# Altium schematic sheet Power.SchDoc
size A4; SheetNumber: 2; SheetTotal: 3
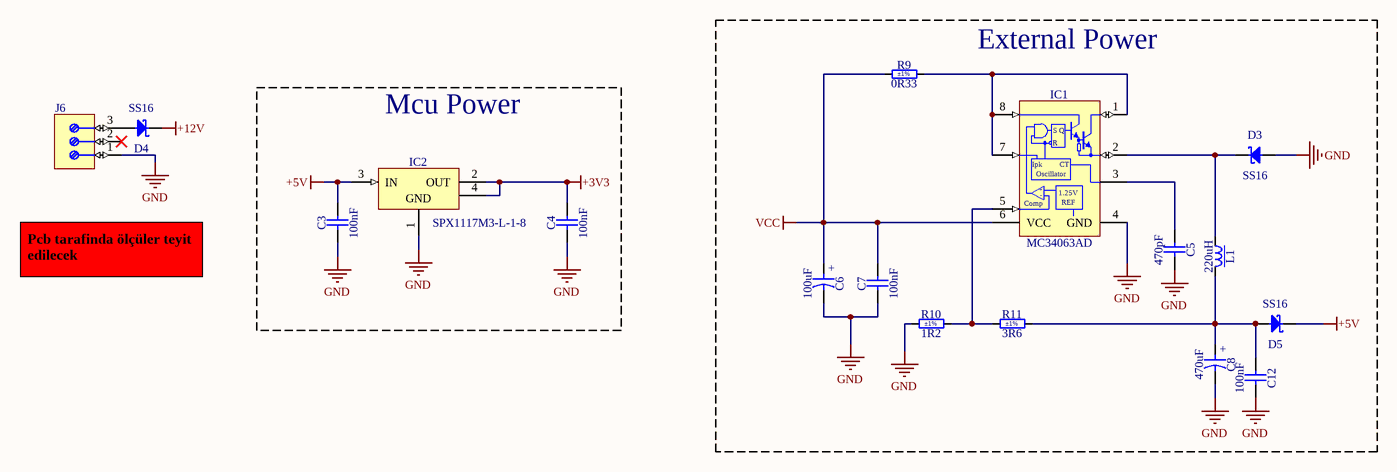
[diagram p0: Power.SchDoc]

## Parts
C3  100nF  [CAPC1608X87N]
C4  100nF  [CAPC1608X87N]
C5  470pF  [CAPC1608X87N]
C6  100uF  [CAPMP7343X200N]
C7  100nF  [CAPC1608X87N]
C8  470uF  [CAPMP7343X310N]
C12  100nF  [CAPC1608X87N]
D3  SS16  [DIOM5127X229N]
D4  SS16  [DIOM5127X229N]
D5  SS16  [DIOM5127X229N]
IC1  MC34063AD  [SOIC127P600X175-8N]
IC2  SPX1117M3-L-1-8  [SOT230P700X180-4N]
J6  (no value)  [PHOENIX_1715734]
L1  220uH  [IND_EPCOS_B82464-G4]
R9  0R33  Tolerance: ±1%  [RESC3216X65N]
R10  1R2  Tolerance: ±1%  [RESC1608X55N]
R11  3R6  Tolerance: ±1%  [RESC1608X55N]

## Blocks framed on the sheet
External Power: C5-C8 C12 D3 D5 IC1 L1 R9-R11
Mcu Power: C3 C4 IC2

## Nets
+3V3: C4.2 IC2.2(OUT) IC2.4(OUT)
+5V: C3.2 D5.1(C) IC2.3(IN)
+12V: D4.1(C)
GND: C3.1 C4.1 C5.2 C6.2 C7.1 C8.2 C12.2 D3.2(A) IC1.4(GND) IC2.1(GND) J6.1 R10.1
VCC: C6.1 C7.2 IC1.6(VCC) R9.1
NetC5_1: C5.1 IC1.3(TC)
NetC8_1: C8.1 C12.1 D5.2(A) L1.2 R11.2
NetD3_1: D3.1(C) IC1.2(SWE) L1.1
NetD4_2: D4.2(A) J6.3
NetIC1_1: IC1.1(SWC) IC1.7(Ipk) IC1.8(DRVC) R9.2
NetIC1_5: IC1.5(COMP) R10.2 R11.1

Not connected (* = marked no-connect by the designer): J6 2*

## Notes on the sheet
- Pcb tarafinda ölçüler teyit edilecek
- (in symbol CTE7343-20_100UF_10V_20%_SANYO_TPC) +
- (in symbol CTE7343-31_470UF_6.3V_10%) +
- (in symbol MC34063AD) S; Q; R; CT; Oscillator; +; -; 1.25V; Comp; REF

## Library data of the parts
C3 C4 C7 C12 = CC0603_100NF_50V_10%_X5R: Non-polarised capacitor; Part Description: SMD Multilayer Chip Ceramic Capacitor; Manufacturer: GENERIC; Manufacturer1 Part Number: C1608X5R1H104K080; Voltage: 50V; TC: X5R; Tolerance: ±10%; Part Number: CC0603_100NF_50V_10%_X5R; Component Kind: Standard; Component Type: Standard; Pin Count: 2; Value: 100nF; Status: None; Manufacturer Part Number: CC0603_100NF_50V_10%_X5R; Case: 0603; Mounted: Yes; Socket: No; SMD: Yes; Sense: No; Manufacturer1 Example: TDK; Manufacturer1 ComponentHeight: 0.9mm; HelpURL: \\cern.ch\dfs\Applications\Altium\Datasheets\CC0603_X5R_TDK_C.pdf; Author: CERN DEM MR; CreateDate: 8.01.2016; LatestRevisionDate: 8.01.2016
C5 = CC0603_470PF_50V_5%_NP0: Non-polarised capacitor; Part Description: SMD Multilayer Chip Ceramic Capacitor; Manufacturer: GENERIC; Manufacturer1 Part Number: 223886715471; Voltage: 50V; TC: C0G/NP0; Tolerance: ±5%; Part Number: CC0603_470PF_50V_5%_NP0; Component Kind: Standard; Component Type: Standard; Pin Count: 2; Value: 470pF; Status: Preferred; Manufacturer Part Number: CC0603_470PF_50V_5%_NP0; Case: 0603; Mounted: Yes; Socket: No; SMD: Yes; Sense: No; Manufacturer1 Example: PHYCOMP; Manufacturer1 ComponentHeight: 0.87mm; HelpURL: \\cern.ch\dfs\Applications\Altium\Datasheets\CC0603_NP0_PHYCOMP.pdf; Author: CERN DEM JLC; CreateDate: 3.12.2007; LatestRevisionDate: 3.12.2007
C6 = CTE7343-20_100UF_10V_20%_SANYO_TPC: Polarised capacitor; Part Description: ESR 0R045 Tantalum Chip Capacitor; Manufacturer: SANYO; Manufacturer Part Number: 10TPC100M; Voltage: 10V; Tolerance: ±20%; Part Number: CTE7343-20_100UF_10V_20%_SANYO_TPC; Component Kind: Standard; Component Type: Standard; Pin Count: 2; Value: 100uF; Status: None; Case: V; Mounted: Yes; Socket: No; SMD: Yes; Sense: No; ComponentHeight: 2mm; HelpURL: \\cern.ch\dfs\Applications\Altium\Datasheets\CTE_SANYO_TPC.pdf; Author: CERN DEM JLC; CreateDate: 29.06.2011; LatestRevisionDate: 29.06.2011
C8 = CTE7343-31_470UF_6.3V_10%: Polarised capacitor; Part Description: Solid Tantalum Chip Capacitor; Manufacturer: GENERIC; Manufacturer1 Part Number: TAJD477K006R; Voltage: 6.3V; Tolerance: ±10%; Part Number: CTE7343-31_470UF_6.3V_10%; Component Kind: Standard; Component Type: Standard; Pin Count: 2; Value: 470uF; Status: Preferred; Manufacturer Part Number: CTE7343-31_470UF_6.3V_10%; Case: D; Mounted: Yes; Socket: No; SMD: Yes; Sense: No; Manufacturer1 Example: AVX; Manufacturer1 ComponentHeight: 3.1mm; HelpURL: \\cern.ch\dfs\Applications\Altium\Datasheets\CTE_AVX_TAJ.pdf; Author: CERN DEM JLC; CreateDate: 3.12.2007; LatestRevisionDate: 3.12.2007
D3-D5 = SS16: Schottky Diode; Part Description: Surface Mount Schottky Barrier Rectifier; Manufacturer: VISHAY GENERAL SEMICONDUCTOR; Voltage: 60V; Power: 1A; PressFit: No; Bonding: No; Part Number: SS16; Component Kind: Standard; Component Type: Standard; Device: SS16; PackageDescription: DO-214-AC/SMA Diode, Molded Body; 5.10mm L X 2.67mm W X 2.29mm H, IPC Medium Density; Manufacturer Part Number: SS16; Pin Count: 2; Case: DO-214AC; Mounted: Yes; Socket: No; SMD: Yes; Sense: No; ComponentHeight: 2.29mm; HelpURL: \\cern.ch\dfs\Applications\Altium\Datasheets\SS16.pdf; Author: CERN DEM JLC; CreateDate: 15.07.2008; LatestRevisionDate: 23.08.2010
IC1 = MC34063AD: 3V to 40V 1.5A Peak Boost/Buck/Inverting Switching Regulator; Manufacturer: TEXAS INSTRUMENTS; PressFit: No; Bonding: No; Part Number: MC34063AD; Component Kind: Standard; Component Type: Standard; Device: MC34063AD; PackageDescription: SOIC 8, Pitch 1.27mm, Body 4x5mm, IPC Medium Density; Part Description: 3V to 40V 1.5A Peak Boost/Buck/Inverting Switching Regulator; Manufacturer Part Number: MC34063AD; Pin Count: 8; Case: SOIC8; Mounted: Yes; Socket: No; SMD: Yes; Sense: No; ComponentHeight: 1.75mm; HelpURL: \\cern.ch\dfs\Applications\Altium\Datasheets\MC34063AD.pdf; Author: CERN DEM JLC; CreateDate: 27.10.2009; LatestRevisionDate: 27.10.2009
IC2 = SPX1117M3-L-1-8: 3-Terminal Regulator 1=GND 2=OUT 3=IN 4=OUT; Part Description: 1.8V 800mA Low Dropout Voltage Regulator; Manufacturer: EXAR; PressFit: No; Bonding: No; Part Number: SPX1117M3-L-1-8; Component Kind: Standard; Component Type: Standard; Device: SPX1117M3-L-1-8; PackageDescription: SOT223, 2.30mm Pitch; 4 Pin, 3.70mm W X 6.70mm L X 1.80mm H body, IPC Medium Density; Manufacturer Part Number: SPX1117M3-L-1-8; Pin Count: 4; Case: SOT223; Mounted: Yes; Socket: No; SMD: Yes; Sense: No; ComponentHeight: 1.8mm; HelpURL: \\cern.ch\dfs\Applications\Altium\Datasheets\SPX1117M3-L-1-8.pdf; Author: CERN DEM JLC; CreateDate: 5.07.2011; LatestRevisionDate: 5.07.2011
J6 = PHOENIX_1715734: Terminal Block, 3 Positions, Screw Connection; Part Description: 17.5A, 400V, Terminal Block, Pitch 5.08mm, 3 Positions, Screw Connection; Manufacturer: PHOENIX CONTACT; Manufacturer Part Number: 1715734 (MKDS 1,5/3-5,08); PressFit: No; Part Number: PHOENIX_1715734; Component Kind: Standard; Component Type: Standard; Pin Count: 3; Mounted: Yes; Socket: No; SMD: No; Sense: No; Status: None; ComponentHeight: 13.8mm; HelpURL: \\cern.ch\dfs\Applications\Altium\Datasheets\PHOENIX_1715734.pdf; Author: CERN DEM JLC; CreateDate: 6.01.2010; LatestRevisionDate: 25.02.2013
L1 = IND_470UH_20%_EPCOS_B82464-G4: Inductor With Core; Part Description: SMT Power Inductor; Manufacturer: EPCOS; Manufacturer Part Number: B82464–G4474–M; Value: 470uH; Power: 0.5A; Resistance: 0.93R; Tolerance: ±20%; Part Number: IND_470UH_20%_EPCOS_B82464-G4; Component Kind: Standard; Component Type: Standard; Pin Count: 2; Mounted: Yes; Socket: No; SMD: Yes; Sense: No; ComponentHeight: 4.8mm; HelpURL: \\cern.ch\dfs\Applications\Altium\Datasheets\IND_EPCOS_B82464-G4.pdf; Author: CERN DEM JLC; CreateDate: 17.11.2008; LatestRevisionDate: 17.11.2008
R9 = R1206_0R33_1%_0.5W_600PPM: Resistor - 1%; Part Description: Low Ohmique High Power Chip Resistor; Manufacturer: YAGEO PHYCOMP; Manufacturer Part Number: RL1206FR-7W0R33 (235051913307); Power: 0.5W; TC: ±600ppm/°C; PressFit: No; Part Number: R1206_0R33_1%_0.5W_600PPM; Component Kind: Standard; Component Type: Standard; Pin Count: 2; Value: 0R33; Status: Not Recommended; Case: 1206; Mounted: Yes; Sense: No; Socket: No; SMD: Yes; ComponentHeight: 0.65mm; HelpURL: \\cern.ch\dfs\Applications\Altium\Datasheets\R1206_PHYCOMP_LRC02P.pdf; Author: CERN DEM JMW; CreateDate: 6.01.2009; LatestRevisionDate: 6.01.2009
R10 = R0603_1R2_1%_0.1W_200PPM: Resistor - 1%; Part Description: General Purpose Thick Film Chip Resistor; Manufacturer: GENERIC; Manufacturer1 Part Number: 232270461208L or RC0603FR-071R2L; Power: 0.1W; TC: ±200ppm/°C; PressFit: No; Part Number: R0603_1R2_1%_0.1W_200PPM; Component Kind: Standard; Component Type: Standard; Pin Count: 2; Value: 1R2; Status: Preferred; Manufacturer Part Number: R0603_1R2_1%_0.1W_200PPM; Case: 0603; Mounted: Yes; Sense: No; Socket: No; SMD: Yes; Manufacturer1 Example: YAGEO PHYCOMP; Manufacturer1 ComponentHeight: 0.65mm; HelpURL: \\cern.ch\dfs\Applications\Altium\Datasheets\R0603_Phycomp_RC0603.pdf; Author: CERN DEM JLC; CreateDate: 3.12.2007; LatestRevisionDate: 17.10.2012
R11 = R0603_3R6_1%_0.1W_200PPM: Resistor - 1%; Part Description: General Purpose Thick Film Chip Resistor; Manufacturer: GENERIC; Manufacturer1 Part Number: 232270463608L or RC0603FR-073R6L; Power: 0.1W; TC: ±200ppm/°C; PressFit: No; Part Number: R0603_3R6_1%_0.1W_200PPM; Component Kind: Standard; Component Type: Standard; Pin Count: 2; Value: 3R6; Status: Preferred; Manufacturer Part Number: R0603_3R6_1%_0.1W_200PPM; Case: 0603; Mounted: Yes; Sense: No; Socket: No; SMD: Yes; Manufacturer1 Example: YAGEO PHYCOMP; Manufacturer1 ComponentHeight: 0.65mm; HelpURL: \\cern.ch\dfs\Applications\Altium\Datasheets\R0603_Phycomp_RC0603.pdf; Author: CERN DEM JLC; CreateDate: 3.12.2007; LatestRevisionDate: 17.10.2012